# Altium schematic sheet Block Diagram.SchDoc: Block Diagram
size Letter; Author: Alfredo Cortellini; Organization: IT Logic; Address1: 5753 Highway 85 N; Address2: Crestview, FL 32536; Address3: United States; DocumentNumber: 3; SheetNumber: 3; SheetTotal: 6; Email: pcb-design@itlogic.cloud
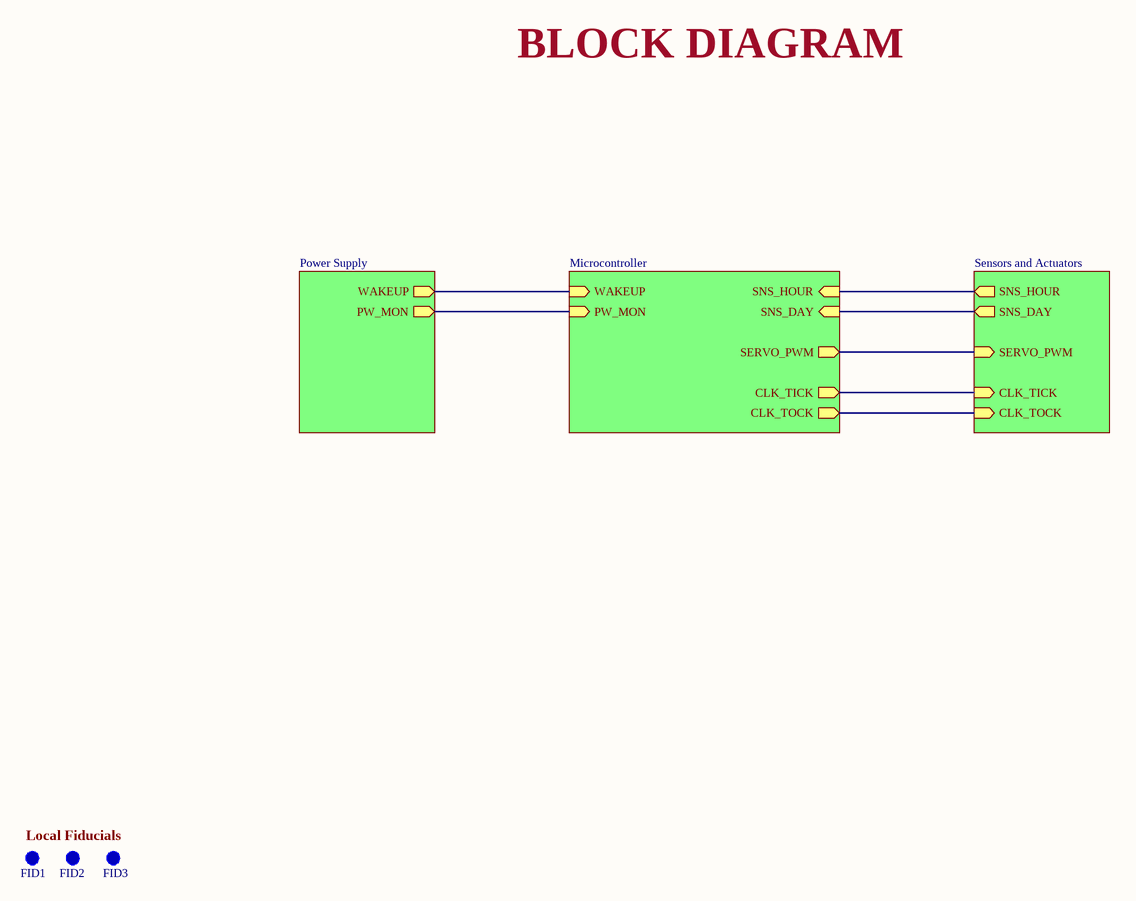
[diagram p0: Block Diagram.SchDoc]

## Parts
FID1  Local Fiducial  [FID-1-2MM]  (value not drawn)
FID2  Local Fiducial  [FID-1-2MM]  (value not drawn)
FID3  Local Fiducial  [FID-1-2MM]  (value not drawn)

## Sub-sheets
Microcontroller = Microcontroller.SchDoc: SNS_HOUR (in), SNS_DAY (in), SERVO_PWM (out), CLK_TICK (out), CLK_TOCK (out), WAKEUP (in), PW_MON (in)
Power Supply = Power Supply.SchDoc: WAKEUP (out), PW_MON (out)
Sensors and Actuators = Sensors and Actuators.SchDoc: SNS_HOUR (out), SNS_DAY (out), SERVO_PWM (in), CLK_TICK (in), CLK_TOCK (in)

## Nets
(unnamed): sheet Power Supply/WAKEUP, sheet Microcontroller/WAKEUP
(unnamed): sheet Power Supply/PW_MON, sheet Microcontroller/PW_MON
(unnamed): sheet Sensors and Actuators/SNS_HOUR, sheet Microcontroller/SNS_HOUR
(unnamed): sheet Sensors and Actuators/SNS_DAY, sheet Microcontroller/SNS_DAY
(unnamed): sheet Sensors and Actuators/SERVO_PWM, sheet Microcontroller/SERVO_PWM
(unnamed): sheet Sensors and Actuators/CLK_TICK, sheet Microcontroller/CLK_TICK
(unnamed): sheet Sensors and Actuators/CLK_TOCK, sheet Microcontroller/CLK_TOCK

## Notes on the sheet
- BLOCK DIAGRAM
- Local Fiducials
- Project:
- Revision:
- Title:
- Sheet:
- of
- Author:
- Date:
- License:
- CC BY-NC-SA 4.0 <https://creativecommons.org/licenses/by-nc-sa/4.0/>

## Library data of the parts
FID1-FID3 = FID-1-2MM: Fiducial 1.0mm Diameter, 2.0mmil Mask